# EAGLE design rpi-cc2652p-uart (EAGLE 9.6.2)
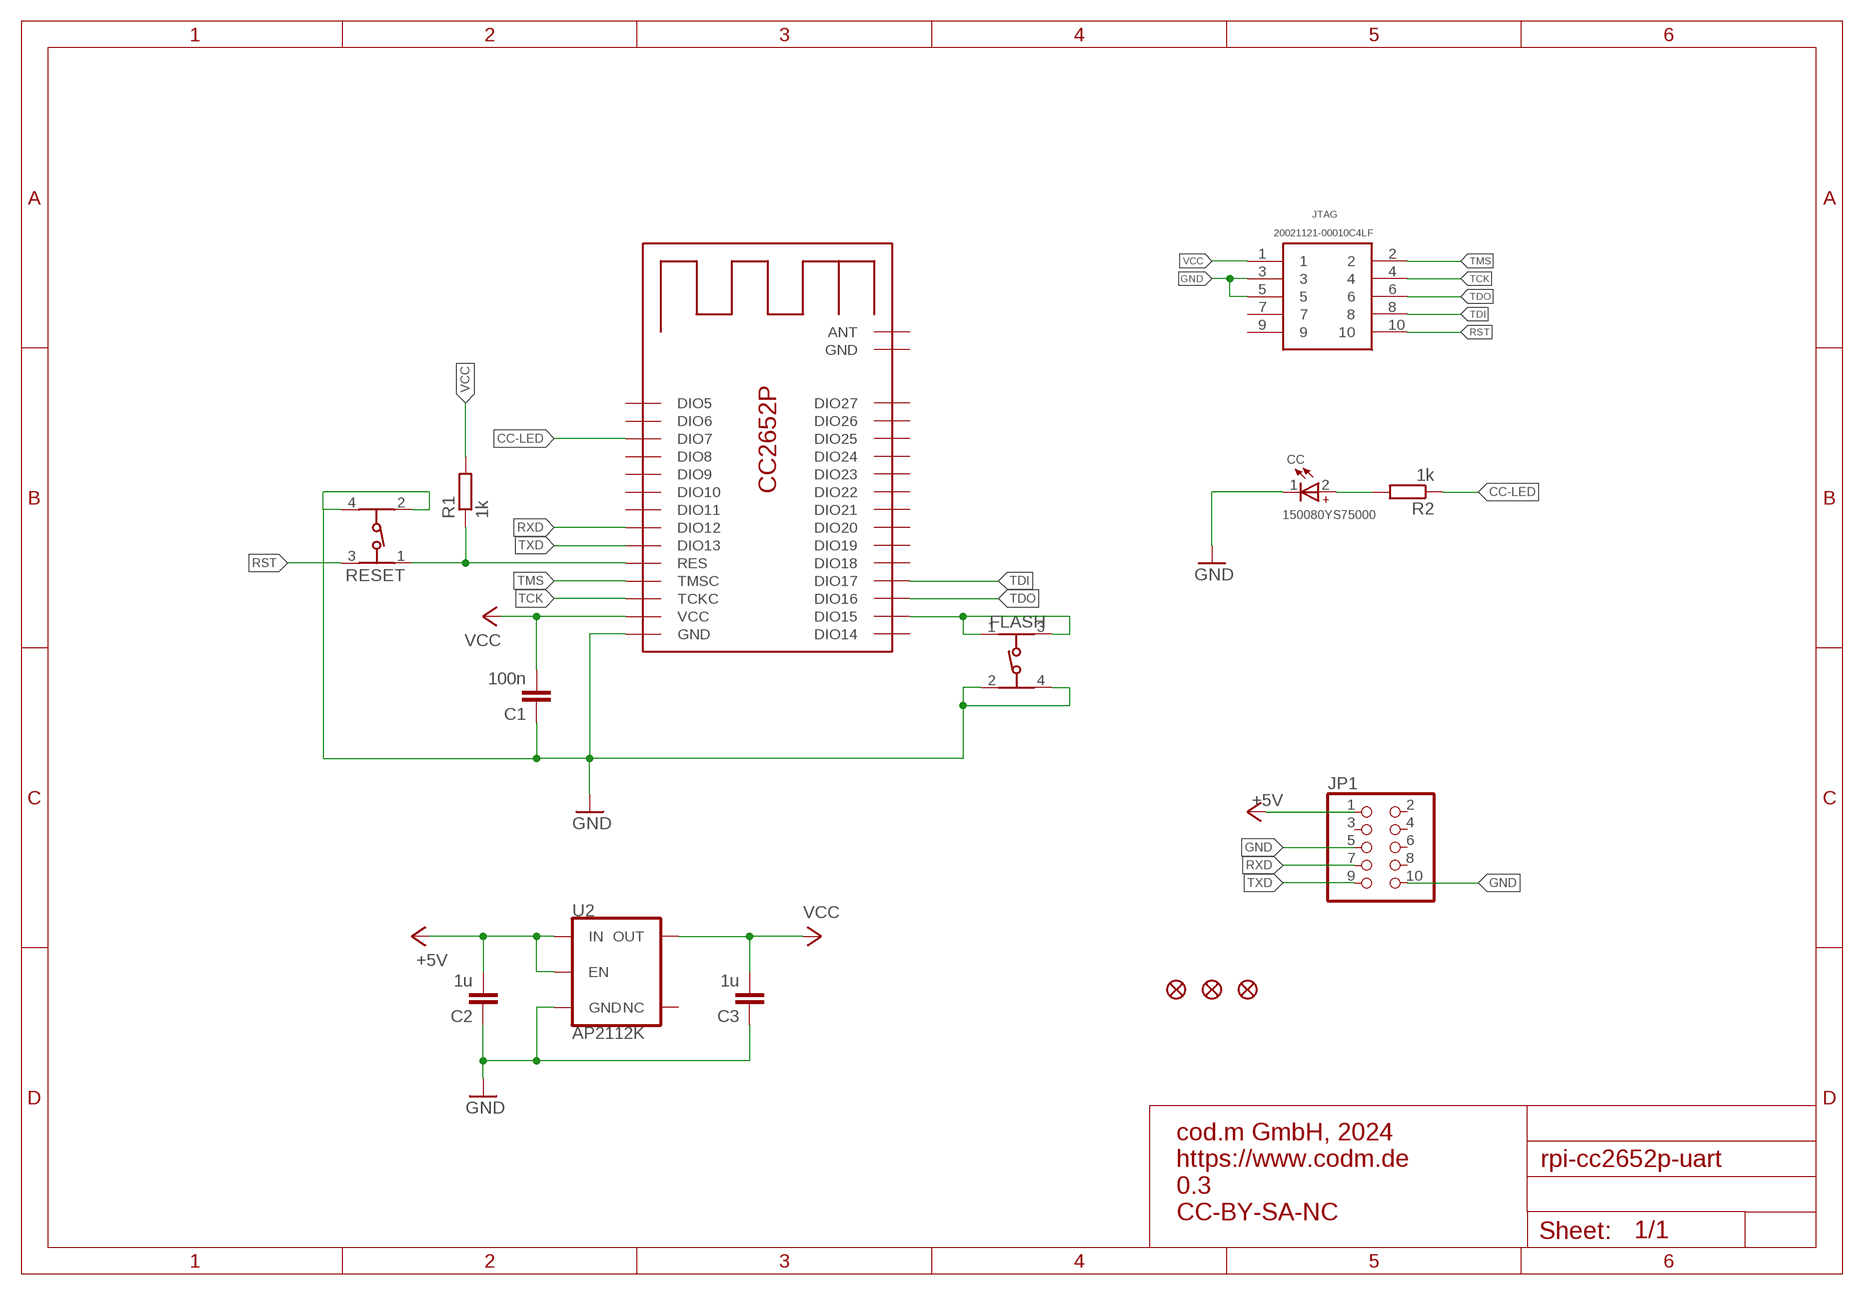
[diagram p0: schematic, sheet 1]

## Parts
C1  100n  C-EUC0603K  [C0603K]
C2  1u  C-EUC0805  [C0805]
C3  1u  C-EUC0805  [C0805]
CC  150080YS75000  WL-SMCW_0805_150080YS75000  [WL-SMCW_0805]
FD1  FIDUCIAL1X2  [FIDUCIAL-1X2]
FD2  FIDUCIAL1X2  [FIDUCIAL-1X2]
FD3  FIDUCIAL1X2  [FIDUCIAL-1X2]
FLASH  434153017835  [434153017835]
JP1  PINHD-2X5  [2X05]
JTAG  20021121-00010C4LF  [2002112100010C4LF]
R1  1k  R-EU_R0603RF  [R0603RF]
R2  1k  R-EU_R0603RF  [R0603RF]
RESET  434153017835  [434153017835]
U1  CC2652P2-DUOWEISI  [CC2652P2-DUOWEISI]
U2  AP2112K  V_REG_AP2112K-3.3V  [SOT23-5]

## Nets
+5V: C2.2 JP1.1 U2.1(IN) U2.3(EN)
CC-LED: R2.1 U1.DIO7
FLASH: FLASH.1 FLASH.3 U1.DIO15
GND: C1.1 C2.1 C3.1 CC.1(-) FLASH.2 FLASH.4 JP1.5 JP1.10 JTAG.3 JTAG.5 RESET.2 RESET.4 U1.GND U2.2(GND)
N$5: CC.2(+) R2.2
RST: JTAG.10 R1.1 RESET.1 RESET.3 U1.RES
RXD: JP1.7 U1.DIO12
TCK: JTAG.4 U1.TCKC
TDI: JTAG.8 U1.DIO17
TDO: JTAG.6 U1.DIO16
TMS: JTAG.2 U1.TMSC
TXD: JP1.9 U1.DIO13
VCC: C1.2 C3.2 JTAG.1 R1.2 U1.VCC U2.5(OUT)
Unconnected: JP1.2 JP1.3 JP1.4 JP1.6 JP1.8 JTAG.7 JTAG.9 U1.ANT U1.DIO5 U1.DIO6 U1.DIO8 U1.DIO9 U1.DIO10 U1.DIO11 U1.DIO14 U1.DIO18 U1.DIO19 U1.DIO20 U1.DIO21 U1.DIO22 U1.DIO23 U1.DIO24 U1.DIO25 U1.DIO26 U1.DIO27 U1.GND@1(GND) U2.4(NC)

## Notes on the sheet
- cod.m GmbH, 2024
  https://www.codm.de
  0.3
  CC-BY-SA-NC

## Library data of the parts
C1-C3 = rcl:C-EU: CAPACITOR, European symbol; SPICEPREFIX: C
CC = Wurth_LEDs_WL-SMCW:WL-SMCW_0805: WL-SMCW SMT Mono-color Chip LED Waterclea Characteristics Low energy consumption High reliability Low current requirement Fast switching No UV/IR radiation Smallest SMD LED package for exceptional brightness Top view LED Wide viewing angle Better solder ability Heat dissipation Applications Backlight for mobile and portable device keypads Indoor and outdoor message boards Flat backlight for LCDs, switches and symbols Display for industrial control systems and traffic Miniaturized color effects Pedestrian mark Optical indicators Tabular backlight: LCD, telephone key-press, power-switch, display board Indoor displays Signals Identifiers Backlight for automobile DVD LED General lighting Toys <https://www.we-online.com/catalog/media/o14904v209%20Family_WL-SMCW.jpg> Details see: www.we-online.com/catalog/WL-SMCW <www.we-online.com/catalog/WL-SMCW/?utm_source=eagle_model&utm_medium=description_link&utm_campaign=eisos_eagle> Updated by Ella Wu, 2022-06-16 2022(C) Wurth Elektronik; CHIP-TECHNOLOGY: AlInGaP; DATASHEET-URL: https://www.we-online.com/redexpert/spec/150080YS75000?ae; DOMINANT-WAVELENGTH: 590nm; EMITTING-COLOR: Yellow; FORWARD-VOLTAGE: 140°; LUMINOUS-INTENSITY: 120mcd; PART-NUMBER: 150080YS75000; PEAK-WAVELENGTH: 595nm
FD1-FD3 = SparkFun-Aesthetics:FIDUCIAL: Fiducial Alignment Points Point-of-reference for pick-and-place machines and other optical instruments.
FLASH RESET = 434153017835_Eagle_WS-TASV_rev20a:434153017835: WS-TASV J-Bend SMT Tact Switch 3.5x2.9 mm Material Properties Cover Material : Stainless Steel Properties Actuator Material:LCP Actuator Flammability Rating:UL94 V-0 Actuator Color:Blue Frame Material:PA46 Frame Flammability Rating:UL94 HB Frame Color:Black Contact Material:Stainless Steel Contact Plating:Silver Terminal Material:Copper Alloy Terminal Plating:Silver VR:12 V (DC) Contact Resistance Initial:100 mΩ Contact Resistance After Life Test:1 Ω RISO:100 MΩ Withstanding Voltage:250 V (AC) Washable:No Qty.:4000 Mechanical Properties Stroke :0.15 mm General Information Operating Temperature:-40 up to +85 °C Washable:No Packaging Properties Packaging:Tape and Reel <https://www.we-online.com/catalog/media/o72753v209%20WS-TASU_434331013822_a_4C.jpg> Details see: https://www.we-online.com/catalog/en/TASV_3_5X2_9_SMD_J-BEND/ Updated by yingchun,Shan;2020-02-18 2020(C) Würth Elektronik; DATASHEET-URL: https://www.we-online.com/catalog/datasheet/434153017835.pdf; H: 1.7mm; OPERATION-FORCE: 350g; PART-NUMBER: 434153017835; QTY: 4000
JP1 = pinhead:PINHD-2X5: PIN HEADER
JTAG = 20021121-00010C4LF:20021121-00010C4LF: Headers & Wire Housings 1.27x1.27mm BTB, Hdr Unshrd, SMT, 10 Pos Source: Datasheet; DESCRIPTION: Headers & Wire Housings 1.27x1.27mm BTB, Hdr Unshrd, SMT, 10 Pos; HEIGHT: 4.55mm; MANUFACTURER_NAME: Amphenol; MANUFACTURER_PART_NUMBER: 20021121-00010C4LF; MOUSER_PART_NUMBER: 649-202112100010C4LF; MOUSER_PRICE-STOCK: https://www.mouser.com/Search/Refine.aspx?Keyword=649-202112100010C4LF
R1 R2 = codm:R-EU_
U1 = codm:CC2652P2-DUOWEISI
U2 = SparkFun-IC-Power:V_REG_AP2112: AP2112 - 600mA CMOS LDO Regulator w/ Enable The AP2112 is CMOS process low dropout linear regulator with enable function, the regulator delivers a guaranteed 600mA (min.) continuous load current. Features Output Voltage Accuracy: ±1.5% Output Current: 600mA (Min.) Foldback Short Current Protection: 50mA Enable Function to Turn ON/OFF VOUT Low Dropout Voltage (3.3V): 250mV (Typ.) @IOUT=600mA Excellent Load Regulation: 0.2%/A (Typ.) Excellent Line Regulation: 0.02%/V (Typ.) Low Quiescent Current: 55μA (Typ.) Low Standby Current: 0.01μA (Typ.) Low Output Noise: 50μVRMS PSRR: 100Hz -65dB, 1kHz -65dB OTSD Protection Stable with 1.0μF Flexible Cap: Ceramic, Tantalum and Aluminum Electrolytic Operation Temperature Range: -40°C to 85°C ESD: MM 400V, HBM 4000V; PROD_ID: VREG-12457; VALUE: 3.3V

## Board
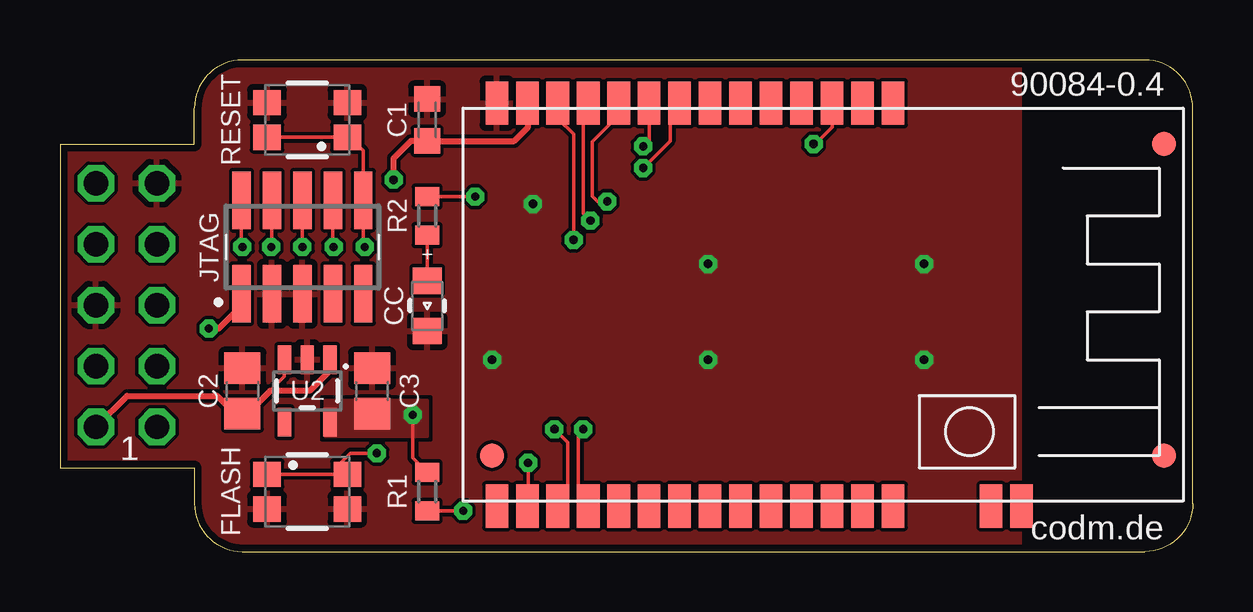
[diagram p1: board, top side]
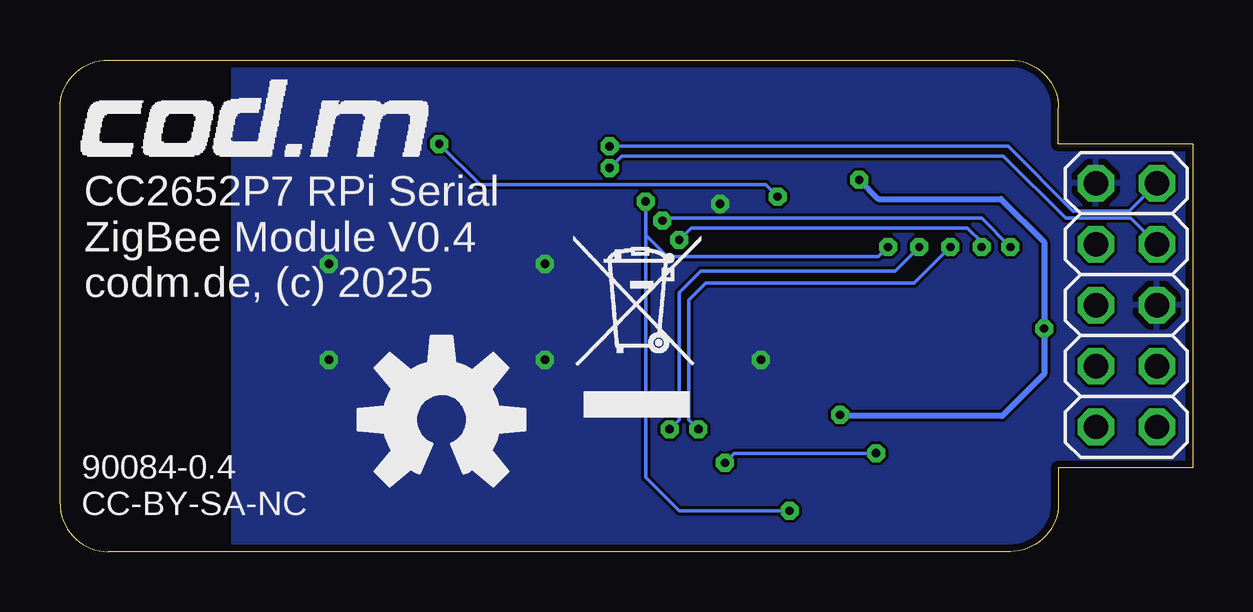
[diagram p2: board, bottom side, seen from below]

Size 47.2 x 20.5 mm. Coordinates in mm from the lower left corner, seen from the top.
Outline: 7.6,0 45.2,0 arc90 47.2,2 47.2,18.5 arc90 45.2,20.5 7.6,20.5 arc90 5.6,18.5 5.6,17 0,17 0,3.5 5.6,3.5 5.6,2 arc90 7.6,0
Copper layers (1*16): Top 0.035mm / dielectric 1.5mm / Bottom 0.035mm
Design rules "aisler_2_layer_complex": minimum track width 0.125mm, minimum drill 0.1mm, track to track 0.125mm, track to pad 0.125mm, pad to pad 0.125mm, via to via 0.125mm, smd to smd 0mil, copper to edge 0.3mm, drill to drill 0.3mm, minimum pad ring 0.2mm, minimum via ring 0.2mm, stop-mask expansion 0mil, vias tented up to drill 0mil, thermal gap 10mil

### Footprints (pad centres in the part's own frame; a part is rotated, then mirrored left to right if it is on the bottom)
C0603K = smd 1.05 x 1.08: 1 -0.875,0; 2 0.875,0
C0805 = smd 1.3 x 1.5: 1 -0.95,0; 2 0.95,0
WL-SMCW_0805 = smd 1.1 x 1.2: 1 -1.05,0; 2 1.05,0
FIDUCIAL-1X2 = smd 1 x 1: 1 0,0
434153017835 = smd 1.15 x 1.05: 1 -1.675,0.725; 2 -1.675,-0.725; 3 1.675,0.725; 4 1.675,-0.725
2X05 = drill 1.016 octagon: 1 -5.08,-1.27; 2 -5.08,1.27; 3 -2.54,-1.27; 4 -2.54,1.27; 5 0,-1.27; 6 0,1.27; 7 2.54,-1.27; 8 2.54,1.27; 9 5.08,-1.27; 10 5.08,1.27
2002112100010C4LF = smd 0.76 x 2.4: 1 -2.54,-1.95; 2 -2.54,1.95; 3 -1.27,-1.95; 4 -1.27,1.95; 5 0,-1.95; 6 0,1.95; 7 1.27,-1.95; 8 1.27,1.95; 9 2.54,-1.95; 10 2.54,1.95
R0603RF = smd 0.8 x 1: 1 -0.8,0; 2 0.8,0
CC2652P2-DUOWEISI = smd 1.8 x 0.94: ANT 16.6,23.27; DIO5 -0.2,17.91; DIO6 -0.2,16.64; DIO7 -0.2,15.37; DIO8 -0.2,14.1; DIO9 -0.2,12.83; DIO10 -0.2,11.56; DIO11 -0.2,10.29; DIO12 -0.2,9.02; DIO13 -0.2,7.75; DIO14 16.6,1.4; DIO15 16.6,2.67; DIO16 16.6,3.94; DIO17 16.6,5.21; DIO18 16.6,6.48; DIO19 16.6,7.75; DIO20 16.6,9.02; DIO21 16.6,10.29; DIO22 16.6,11.56; DIO23 16.6,12.83; DIO24 16.6,14.1; DIO25 16.6,15.37; DIO26 16.6,16.64; DIO27 16.6,17.91; GND -0.2,1.4; GND@1 16.6,22; RES -0.2,6.48; TCKC -0.2,3.94; TMSC -0.2,5.21; VCC -0.2,2.67
SOT23-5 = smd 0.55 x 1.2: 1 -0.95,-1.3; 2 0,-1.3; 3 0.95,-1.3; 4 0.95,1.3; 5 -0.95,1.3

### Placement (x,y rotation side)
C1  15.3,18 270 top
C2  7.6,6.7 270 top
C3  13,6.7 270 top
CC  15.3,10.25 90 top
FD1  46,17 0 top
FD2  46,4 0 top
FD3  18,4 0 top
FLASH  10.3,2.5 0 top
JP1  2.77,10.28 90 bottom
JTAG  10.1,12.7 0 top
R1  15.3,2.5 90 top
R2  15.3,14 270 top
RESET  10.3,18 180 top
U1  16.8,18.5 270 top
U2  10.3,6.7 180 top
U$2  [CODM-LOGO]  46.3,16.5 0 bottom
U$3  [WEEE-LOGO-5MM]  25.8,5.6 0 bottom
U$4  [OSHW-LOGO-L]  31.3,5.5 0 bottom

### Tracks (layer width: path | path; a pad name or v marks a point on that pad's centre or on a via)
+5V
  Top 0.152: U2.3 9.35,7.3 8.75,6.7
  Top 0.254: JP1.1 2.8,6.5 6.55,6.5 7.3,5.75 C2.2 7.8,5.75 8.75,6.7 10.4,6.7 11.25,7.55 U2.1
CC-LED  (via drill 0.35)
  Top 0.152: U1.DIO7 32.17,17.7 31.47,17 v31.4,17 | v17.3,14.8 R2.1
  Bottom 0.152: v31.4,17 29.7,15.3 17.8,15.3 v17.3,14.8
FLASH  (via drill 0.35)
  Top 0.152: FLASH.1 FLASH.3 11.68,3.67 12.1,4.1 v13.2,4.1 | U1.DIO15 19.5,1.77 v19.5,3.7
  Bottom 0.152: v13.2,4.1 19.1,4.1 v19.5,3.7
GND  (via drill 0.35)
  other vias: 36,8 27,8 18,8 36,12 27,12 19.7,14.5
  pour Top (isolate 0.15, rank 2): 0,-0.1 40,-0.1 40,21 0,21
  pour Bottom: 0,0 40,0 40,21 0,21
N$5
  Top 0.152: R2.2 CC.2
RST  (via drill 0.35)
  Top 0.152: RESET.3 RESET.1 12.07,17.27 12.64,16.71 JTAG.10 12.64,12.76 v12.7,12.7 | U1.RES 23.28,18.2 22.18,17.1 22.18,14.82 22.4,14.6 v22.8,14.6 | R1.1 v16.8,1.7
  Bottom 0.152: v12.7,12.7 13.1,12.3 21.9,12.3 22.8,13.2 v22.8,14.6 22.8,3.1 21.4,1.7 v16.8,1.7
RXD  (via drill 0.35)
  Top 0.152: U1.DIO12 25.42,18.3 25.42,17.12 v24.3,16
  Bottom 0.152: v24.3,16 23.8,16.5 7.9,16.5 5.3,13.9 2.58,13.9 JP1.7
TCK  (via drill 0.35)
  Top 0.152: JTAG.4 8.83,12.73 v8.8,12.7 | v21.4,13 21.4,17.4 20.74,18.06 U1.TCKC
  Bottom 0.152: v8.8,12.7 8.8,12.9 9.4,13.5 20.9,13.5 v21.4,13
TDI  (via drill 0.35)
  Top 0.152: JTAG.8 11.37,12.73 v11.4,12.7 | v21.8,5.1 21.6,4.9 21.6,2.31 U1.DIO17
  Bottom 0.152: v11.4,12.7 12.4,11.7 20.5,11.7 21.4,10.8 21.4,5.5 v21.8,5.1
TDO  (via drill 0.35)
  Top 0.152: JTAG.6 v10.1,12.7 | v20.6,5.1 21.15,4.55 21.15,2.31 U1.DIO16
  Bottom 0.152: v10.1,12.7 11.6,11.2 20.3,11.2 21,10.5 21,5.5 v20.6,5.1
TMS  (via drill 0.35)
  Top 0.152: JTAG.2 7.56,12.74 v7.6,12.7 | U1.TMSC 21.8,18.49 21.8,14.1 v22.1,13.8
  Bottom 0.152: v7.6,12.7 8.8,13.9 22,13.9 v22.1,13.8
TXD  (via drill 0.35)
  Top 0.152: U1.DIO13 24.55,17.15 v24.3,16.9
  Bottom 0.152: v24.3,16.9 7.7,16.9 5,14.2 2.65,14.2 JP1.9
VCC  (via drill 0.35)
  Top 0.152: v14.7,5.7 14.7,3.9 R1.2
  Top 0.254: v6.2,9.3 6.61,9.3 7.56,10.25 JTAG.1 | U1.VCC 19.5,18.67 19.5,17.7 18.93,17.12 C1.2 14.62,17.12 13.9,16.4 v13.9,15.5
  Bottom 0.254: v13.9,15.5 13.1,14.7 8,14.7 6.2,12.9 v6.2,9.3 6.2,7.4 7.95,5.65 14.65,5.65 v14.7,5.7
  pour Top (no thermals): 11.05,4.8 11.05,6.3 15.3,6.3 15.3,4.8

### Text on the board
tNames: 90084-0.4 | 1 | codm.de
bNames: CC2652P7 RPi Serial / ZigBee Module V0.4 / codm.de, (c) 2025 | 90084-0.4 / CC-BY-SA-NC